# Altium project SHS_LCD176X220.PrjPcb
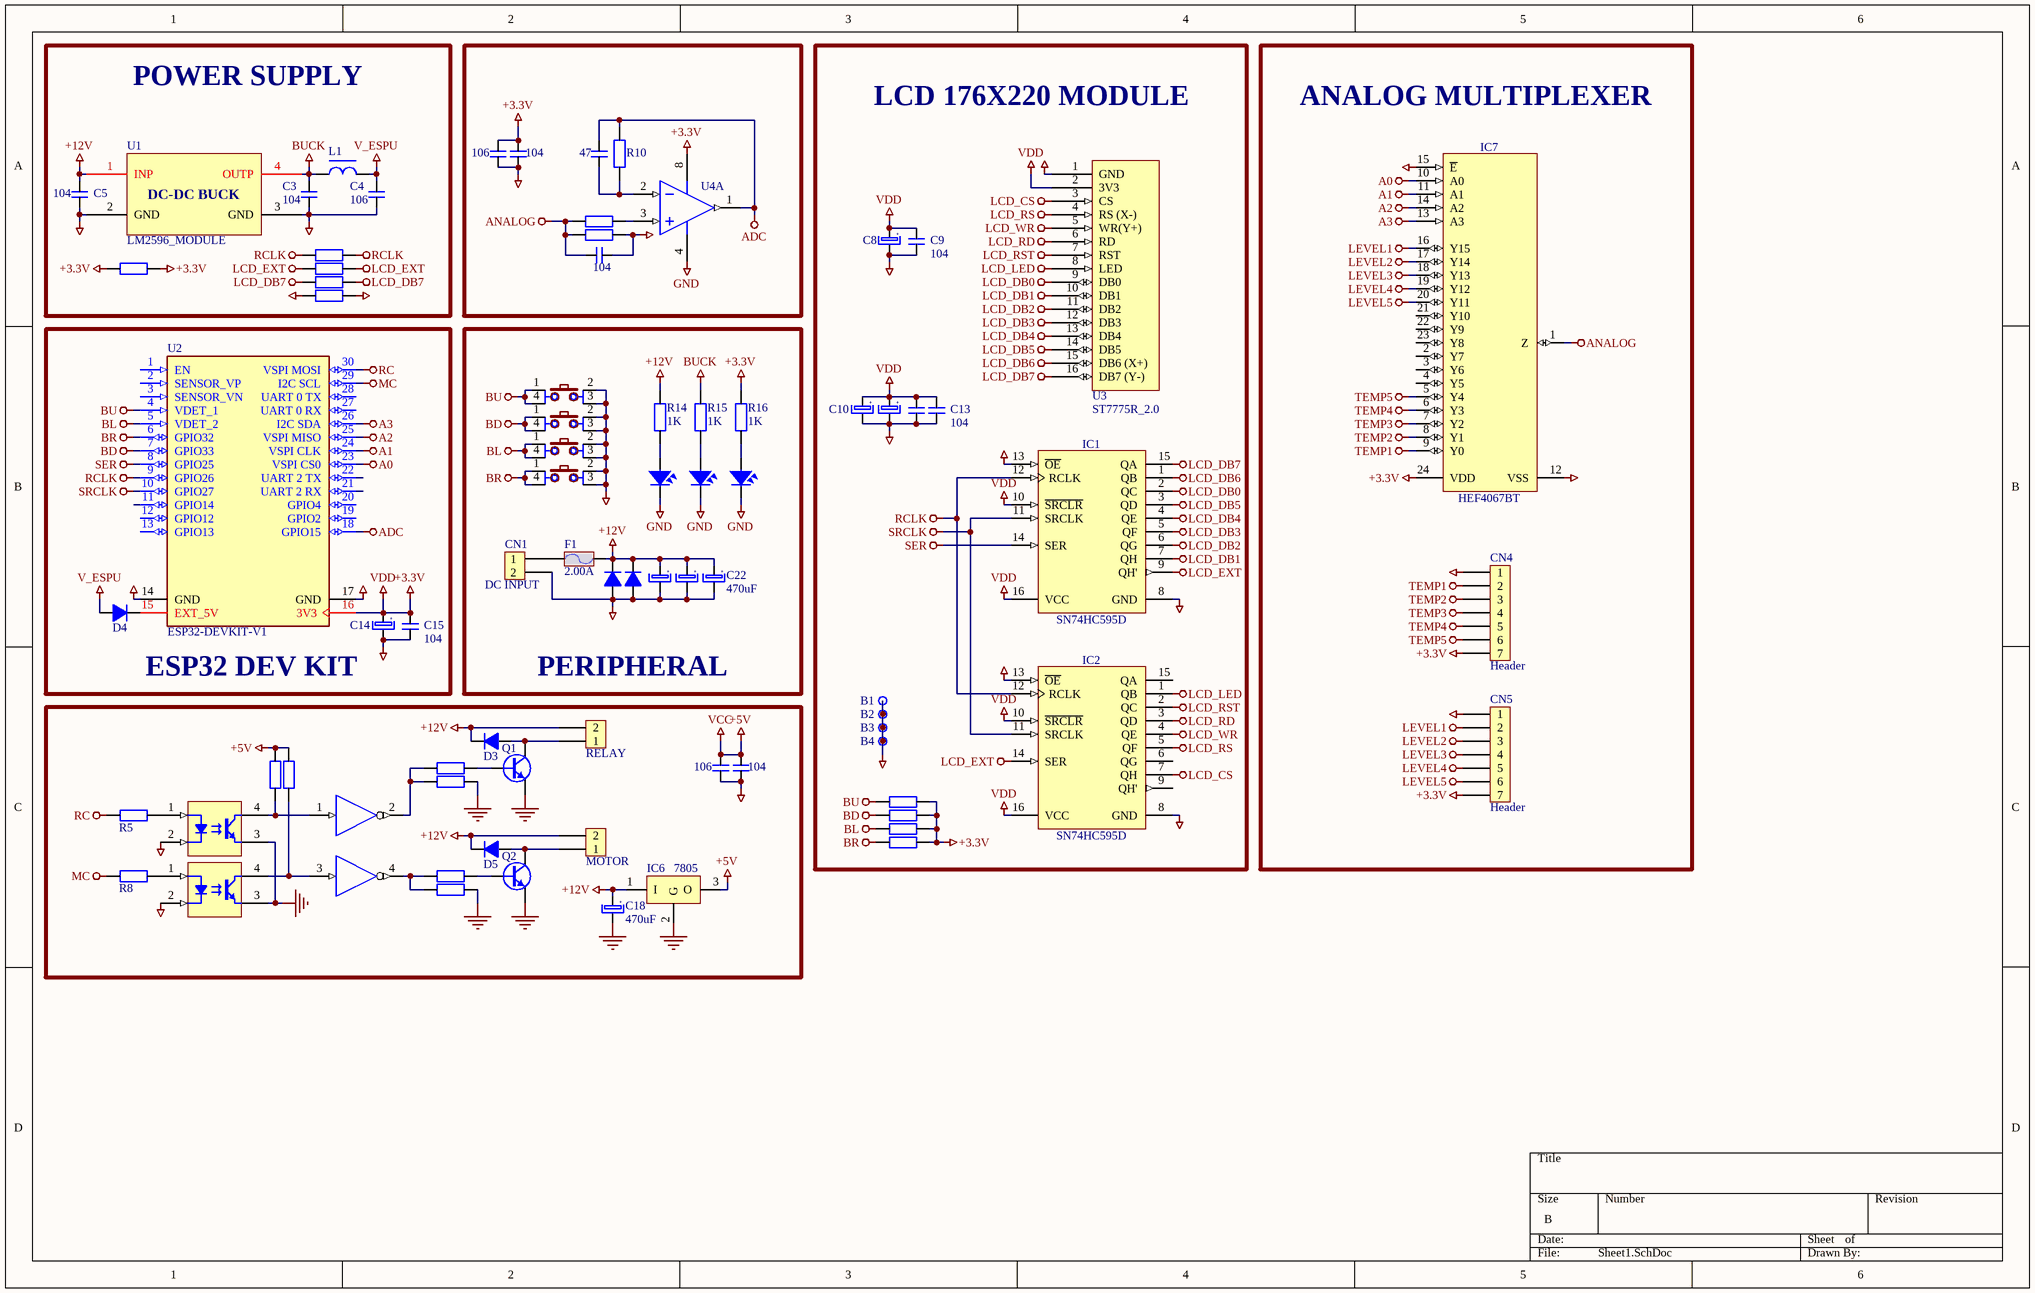
[diagram p0: Sheet1.SchDoc]
1 sheet, 80 parts. Net scope: global (net labels, ports and power ports of the same name join across sheets).
Board file: PCB1.PcbDoc

## Sheet Sheet1.SchDoc
size B

### Parts
B1  Plated Hole  [MTG300_600]  (value not drawn)
B2  Plated Hole  [MTG300_600]  (value not drawn)
B3  Plated Hole  [MTG300_600]  (value not drawn)
B4  Plated Hole  [MTG300_600]  (value not drawn)
C1  106  [CAP-SMD-0805]
C2  104  [CAP-SMD-0805]
C3  104  [Cap-Non-150mil]
C4  106  [CAP-SMD-0805]
C5  104  [Cap-Non-150mil]
C6  47  [CAP-SMD-0805]
C7  104  [CAP-SMD-0805]
C8  220uF  [Cap-P-2.5/5]  (value not drawn)
C9  104  [Cap-Non-150mil]
C10  220uF  [Cap-P-2.5/5]  (value not drawn)
C11  220uF  [Cap-P-2.5/5]  (value not drawn)
C12  104  [Cap-Non-150mil]  (value not drawn)
C13  104  [Cap-Non-150mil]
C14  220uF  [Cap-P-2.5/5]  (value not drawn)
C15  104  [Cap-Non-150mil]
C16  106  [CAP-SMD-0805]
C17  104  [CAP-SMD-0805]
C18  470uF  [Cap-P-3.8/6.3]
C20  470uF  [Cap-P-3.8/6.3]  (value not drawn)
C21  470uF  [Cap-P-3.8/6.3]  (value not drawn)
C22  470uF  [Cap-P-3.8/6.3]
CN1  DC INPUT  [KF2/5.08]
CN2  RELAY  [KF2/5.08]
CN3  MOTOR  [KF2/5.08]
CN4  Header  [Header 7P]
CN5  Header  [Header 7P]
D1  SS14  [SOD 106]  (value not drawn)
D2  SS14  [SOD 106]  (value not drawn)
D3  SS14  [SOD 106]  (value not drawn)
D4  SS14  [SOD 106]  (value not drawn)
D5  SS14  [SOD 106]  (value not drawn)
F1  2.00A  [Fuse-Dip1]
IC1  SN74HC595D  [SOIC127P600X175-16N]
IC2  SN74HC595D  [SOIC127P600X175-16N]
IC3  FOD817DSD  [DIP4]  (value not drawn)
IC4  74HC14D  [SOIC127P600X175-14N]  (value not drawn)  (parts A,B of 6)
IC5  FOD817DSD  [DIP4]  (value not drawn)
IC6  7805  [TO252]
IC7  HEF4067BT  [SOIC127P1032X265-24N]
L1  470uH  [L-DIP-M-5.3]  (value not drawn)
LED1  POWER  [LED-0805]  (value not drawn)
LED2  ESP-5.0V  [LED-0805]  (value not drawn)
LED3  ESP-3.3V  [LED-0805]  (value not drawn)
Q1  MJD122G  [TO228P991X239-3N-R552X520]  (value not drawn)
Q2  MJD122G  [TO228P991X239-3N-R552X520]  (value not drawn)
R1  1K  [RES-SMD-0805]  (value not drawn)
R2  1K  [RES-SMD-0805]  (value not drawn)
R3  1K  [RES-SMD-0805]  (value not drawn)
R4  10K  [RES-SMD-0805]  (value not drawn)
R5  1K  [RES-SMD-0805]  (value not drawn)
R6  1K  [RES-SMD-0805]  (value not drawn)
R7  10K  [RES-SMD-0805]  (value not drawn)
R8  1K  [RES-SMD-0805]  (value not drawn)
R10  10K  [RES-SMD-0805]  (value not drawn)
R11  10K  [RES-SMD-0805]  (value not drawn)
R12  1K  [RES-SMD-0805]  (value not drawn)
R13  1K  [RES-SMD-0805]  (value not drawn)
R14  1K  [RES-SMD-0805]
R15  1K  [RES-SMD-0805]
R16  1K  [RES-SMD-0805]
R17  0R  [RES-SMD-0805]  (value not drawn)
R18  0R  [RES-SMD-0805]  (value not drawn)
R19  0R  [RES-SMD-0805]  (value not drawn)
R20  0R  [RES-SMD-1206]  (value not drawn)
R21  1K  [RES-SMD-0805]  (value not drawn)
R22  1K  [RES-SMD-0805]  (value not drawn)
R23  1K  [RES-SMD-0805]  (value not drawn)
R27  0R  [RES-SMD-1206]  (value not drawn)
SW1  UP  [Button-Dip4/6x6]  (value not drawn)
SW2  DOWN  [Button-Dip4/6x6]  (value not drawn)
SW3  LEFT  [Button-Dip4/6x6]  (value not drawn)
SW4  RIGHT  [Button-Dip4/6x6]  (value not drawn)
U1  LM2596_MODULE  [LM2596_MODULE]
U2  ESP32-DEVKIT-V1  [MODULE_ESP32-DEVKITC-32D]
U3  ST7775R_2.0  [LCD_176X220_MODULE]
U4  LM6132  [SOIC-8S]  (value not drawn)  (part A of 2)

### Blocks framed on the sheet
POWER SUPPLY: C3-C5 L1 R17-R20 R27 U1
LCD 176X220 MODULE: B1-B4 C8-C13 IC1 IC2 R13 R21-R23 U3
ANALOG MULTIPLEXER: CN4 CN5 IC7
ESP32 DEV KIT: C14 C15 D4 U2
PERIPHERAL: C20-C22 CN1 D1 D2 F1 LED1-LED3 R14-R16 SW1-SW4

### Nets
+3.3V: C1.2 C2.2 C8.1 C9.2 C10.1 C11.1 C12.2 C13.2 C14.1 C15.2 CN4.7 CN5.7 IC1.10(~{SRCLR}) IC1.16(VCC) IC2.10(~{SRCLR}) IC2.16(VCC) IC7.24(VDD) R13.1 R16.2 R21.1 R22.1 R23.1 R27.1 R27.2 U2.16(3V3) U3.2(3V3) U4.8(V+)  [also labelled VDD]
+5V: C16.2 C17.2 IC4.14(VCC) IC6.3(O) R2.2 R3.2  [also labelled VCC]
+12V: C5.1 C18.1 C20.1 C21.1 C22.1 CN2.2 CN3.2 D1.2(K) D2.2(K) D3.2(K) D5.2(K) F1.2 IC6.1(I) R14.2 U1.1(INP)
A0: IC7.10(A0) U2.23(VSPI_CS0)
A1: IC7.11(A1) U2.24(VSPI_CLK)
A2: IC7.14(A2) U2.25(VSPI_MISO)
A3: IC7.13(A3) U2.26(I2C_SDA)
ADC: C6.2 R10.2 U2.18(GPIO15) U4.1(OUTA)
ANALOG: C7.1 IC7.1(Z) R11.1 R12.1
BD: R13.2 SW2.1 SW2.4 U2.7(GPIO33)
BL: R22.2 SW3.1 SW3.4 U2.5(VDET_2)
BR: R21.2 SW4.1 SW4.4 U2.6(GPIO32)
BU: R23.2 SW1.1 SW1.4 U2.4(VDET_1)
BUCK: C3.1 L1.1 R15.2 U1.4(OUTP)
GND: B1.1 B2.1 B3.1 B4.1 C1.1 C2.1 C3.2 C4.1 C5.2 C7.2 C8.2 C9.1 C10.2 C11.2 C12.1 C13.1 C14.2 C15.1 C16.1 C17.1 C18.2 C20.2 C21.2 C22.2 CN1.2 CN4.1 CN5.1 D1.1(A) D2.1(A) IC1.8(GND) IC1.13(~{OE}) IC2.8(GND) IC2.13(~{OE}) IC3.2(C) IC3.3(E) IC4.7(GND) IC5.2(C) IC5.3(E) IC6.2(G) IC7.12(VSS) IC7.15(~{E}) LED1.2 LED2.2 LED3.2 Q1.2(E) Q2.2(E) R4.1 R7.1 R12.2 R20.1 R20.2 SW1.2 SW1.3 SW2.2 SW2.3 SW3.2 SW3.3 SW4.2 SW4.3 U1.2(GND) U1.3(GND) U2.14(GND) U2.17(GND) U3.1(GND) U4.4(V-)
LCD_CS: IC2.7(QH) U3.3(CS)
LCD_DB0: IC1.2(QC) U3.9(DB0)
LCD_DB1: IC1.7(QH) U3.10(DB1)
LCD_DB2: IC1.6(QG) U3.11(DB2)
LCD_DB3: IC1.5(QF) U3.12(DB3)
LCD_DB4: IC1.4(QE) U3.13(DB4)
LCD_DB5: IC1.3(QD) U3.14(DB5)
LCD_DB6: IC1.1(QB) U3.15(DB6_(X+))
LCD_DB7: IC1.15(QA) R18.1 R18.2 U3.16(DB7_(Y-))
LCD_EXT: IC1.9(QH') IC2.14(SER) R19.1 R19.2
LCD_LED: IC2.1(QB) U3.8(LED)
LCD_RD: IC2.3(QD) U3.6(RD)
LCD_RS: IC2.5(QF) U3.4(RS_(X-))
LCD_RST: IC2.2(QC) U3.7(RST)
LCD_WR: IC2.4(QE) U3.5(WR(Y+))
LEVEL1: CN5.2 IC7.16(Y15)
LEVEL2: CN5.3 IC7.17(Y14)
LEVEL3: CN5.4 IC7.18(Y13)
LEVEL4: CN5.5 IC7.19(Y12)
LEVEL5: CN5.6 IC7.20(Y11)
MC: R8.2 U2.29(I2C_SCL)
RC: R5.2 U2.30(VSPI_MOSI)
RCLK: IC1.12(RCLK) IC2.12(RCLK) R17.1 R17.2 U2.9(GPIO26)
SER: IC1.14(SER) U2.8(GPIO25)
SRCLK: IC1.11(SRCLK) IC2.11(SRCLK) U2.10(GPIO27)
TEMP1: CN4.2 IC7.9(Y0)
TEMP2: CN4.3 IC7.8(Y1)
TEMP3: CN4.4 IC7.7(Y2)
TEMP4: CN4.5 IC7.6(Y3)
TEMP5: CN4.6 IC7.5(Y4)
V_ESPU: C4.2 D4.1(A) L1.2
NetC6_1: C6.1 R10.1 U4.2(INA-)
NetCN1_1: CN1.1 F1.1
NetCN2_1: CN2.1 D3.1(A) Q1.3(C)
NetCN3_1: CN3.1 D5.1(A) Q2.3(C)
NetD4_2: D4.2(K) U2.15(EXT_5V)
NetIC3_1: IC3.1(A) R5.1
NetIC3_4: IC3.4(C) IC4.1(IN) R2.1
NetIC4_2: IC4.2(OUT) R1.1 R4.2
NetIC4_3: IC4.3(IN) IC5.4(C) R3.1
NetIC4_4: IC4.4(OUT) R6.1 R7.2
NetIC5_1: IC5.1(A) R8.1
NetLED1_1: LED1.1 R14.1
NetLED2_1: LED2.1 R15.1
NetLED3_1: LED3.1 R16.1
NetQ1_1: Q1.1(B) R1.2
NetQ2_1: Q2.1(B) R6.2
NetR11_2: R11.2 U4.3(INA+)

Not connected (* = marked no-connect by the designer): IC2 6(QG) 9(QH') 15(QA); IC7 2(Y7) 3(Y6) 4(Y5) 21(Y10) 22(Y9) 23(Y8); U2 1(EN) 2(SENSOR_VP) 3(SENSOR_VN) 11(GPIO14) 12(GPIO12) 13(GPIO13) 19(GPIO2) 20(GPIO4) 21(UART_2_RX) 22(UART_2_TX) 27(UART_0_RX) 28(UART_0_TX)

### Notes on the sheet
- (in symbol Cap-Pol-Dip) +
- (in symbol LM2596_MODULE) DC-DC BUCK

### Library data of the parts
B1-B4 = PLATED_HOLE3.0_PAD6.0: Single Terminal Socket; Part Description: Plated Through Hole: Hole Dia.=3.0mm Pad Dia.=6.0mm; Mounted: No; Part Number: PLATED_HOLE3.0_PAD6.0; Component Kind: Standard (No BOM); Component Type: Standard (No BOM); Pin Count: 1; Family: Plated Hole; Socket: No; SMD: No; Sense: No; Status: None; ComponentHeight: 0mm; HelpURL: Undefined; Author: CERN DEM JLC; CreateDate: 5/26/2008; LatestRevisionDate: 5/26/2008; PackageDescription: Plated Through Hole: Hole Dia.=3.0mm Pad Dia.=6.0mm
C1 C2 C4 C6 C7 C16 C17 = Cap-Non-SMD: Non-polar capacitor
C3 C5 C9 C12 C13 C15 = Cap-Non-Dip: Non-polar capacitor
C8 C10 C11 C14 C18 C20-C22 = Cap-Pol-Dip: Polarized capacitor
CN1-CN3 = KF 2
CN4 CN5 = Header 7
D1-D5 = Diode SMD
F1 = Fuse Dip
IC1 IC2 = SN74HC595D: 8-Bit Shift Register With 3-State Output Register; Part Description: 8-Bit Shift Register With 3-State Output Registers; Manufacturer: TEXAS INSTRUMENTS; PressFit: No; Bonding: No; Part Number: SN74HC595D; Component Kind: Standard; Component Type: Standard; Device: SN74HC595D; PackageDescription: SOIC 16, Pitch 1.27mm - Body 4x10mm, IPC Medium Density; Manufacturer Part Number: SN74HC595D; Pin Count: 16; Case: SOIC16; Mounted: Yes; Socket: No; SMD: Yes; Sense: No; ComponentHeight: 1.75mm; Author: CERN DEM JLC; HelpURL: \\cern.ch\dfs\Applications\Altium\Datasheets\SN74HC595D.pdf; CreateDate: 6/5/2012; LatestRevisionDate: 6/5/2012
IC3 IC5 = FOD817DSD: Single Optocoupler; Part Description: 4-Pin High Operating Temperature Phototransistor Optocoupler; Manufacturer: FAIRCHILD SEMICONDUCTOR; PressFit: No; Bonding: No; Part Number: FOD817DSD; Component Kind: Standard; Component Type: Standard; Device: FOD817DSD; Footprint: FAIRCHILD_FOD817DSD; PackageDescription: SOIC, 2.54mm Pitch, 4 Pin, Body 6.5mm W X 4.6mm L X 4.6mm H; Manufacturer Part Number: FOD817DSD; Pin Count: 4; Case: SOIC4; Mounted: Yes; Socket: No; SMD: Yes; Sense: No; ComponentHeight: 4.6mm; HelpURL: \\cern.ch\dfs\Applications\Altium\Datasheets\FOD817DSD.pdf; Author: CERN DEM JLC; CreateDate: 7/21/2014; LatestRevisionDate: 7/21/2014
IC4 = 74HC14D: Hex Schmitt-Trigger Inverter; Part Description: Hex  Inverterting Schmitt-Trigger; Manufacturer: NXP SEMICONDUCTORS; PressFit: No; Bonding: No; Part Number: 74HC14D; Component Kind: Standard; Component Type: Standard; Device: 74HC14D; PackageDescription: SOIC 14, Pitch 1.27mm - Body 4x8.75mm, IPC Medium Density; Manufacturer Part Number: 74HC14D; Pin Count: 14; Case: SOIC14; Mounted: Yes; Socket: No; SMD: Yes; Sense: No; ComponentHeight: 1.75mm; Author: CERN DEM JLC; HelpURL: \\cern.ch\dfs\Applications\Altium\Datasheets\74HC14D.pdf; CreateDate: 8/26/2014; LatestRevisionDate: 8/26/2014
IC6 = 7805: Power IC, 5V-1A
IC7 = HEF4067BT: 16-Channel Analog Multiplexer/Demultiplexer; Manufacturer: NXP SEMICONDUCTORS; PressFit: No; Bonding: No; Part Number: HEF4067BT; Component Kind: Standard; Component Type: Standard; Device: HEF4067BT; PackageDescription: SOIC, 1.27mm Pitch; 24 Pin,7.50mm W X 15.40mm L X 2.65mm H Body, IPC Medium Density; Part Description: 16-Channel Analog Multiplexer/Demultiplexer; Manufacturer Part Number: HEF4067BT; Pin Count: 24; Case: SOIC24; Mounted: Yes; Socket: No; SMD: Yes; Sense: No; ComponentHeight: 2.65mm; Author: CERN DEM JLC; HelpURL: \\cern.ch\dfs\Applications\Altium\Datasheets\HEF4067BT.pdf; CreateDate: 5/14/2013; LatestRevisionDate: 5/14/2013
L1 = IND-DIP-1: Inductor; Value: 150 mH
LED1-LED3 = LED_SMD
Q1 Q2 = MJD340G: NPN Transistor; Part Description: 300V 500mA 15W NPN High Voltage Power Transistor; Manufacturer: ON SEMICONDUCTOR; PressFit: No; Bonding: No; Part Number: MJD340G; Component Kind: Standard; Component Type: Standard; Device: MJD340G; PackageDescription: TO-252AA DPAK TO, 2.28mm pitch; 2 pin,9.905mm L X 6.095mm W X 2.39mm H body, IPC Medium Density; Manufacturer Part Number: MJD340G; Pin Count: 3; Case: DPAK; Mounted: Yes; Socket: No; SMD: Yes; Sense: No; ComponentHeight: 2.38mm; HelpURL: \\cern.ch\dfs\Applications\Altium\Datasheets\MJD340G.pdf; Author: CERN DEM JLC; CreateDate: 9/23/2014; LatestRevisionDate: 9/23/2014
R1-R8 R13-R16 R21-R23 R27 = Res 1/4W: Resistor 1/4W
R10-R12 R17-R20 = Res SMD: Resistor SMD
SW1-SW4 = Button-4: Switch button 4 pin; Value: Button chip 4 pin
U2 = ESP32-DEVKIT-V1: - Transceiver; 802.11 b/g/n _Wi-Fi, WiFi, WLAN_, Bluetooth® Smart Ready 4.x Dual Mode For Use With ESP-WROOM-32; MF: Espressif Systems; MP: ESP32-DEVKITC-32D; Package: None; Price: None; Availability: Unavailable; SnapEDA_Link: https://www.snapeda.com/parts/ESP32-DEVKITC-32D/Espressif%20Systems/view-part/2777395/?ref=snap; Value: *
U3 = LCD_176x220_ST7775R: ComponentLink1Description: Wiki; ComponentLink1URL: http://www.lcdwiki.com/2.8inch_SPI_Module_ILI9341_SKU:MSP2807
U4 = LM6132AIM: Dual Low Power 10 MHz Rail-to-Rail I/O Operational Amplifier, 8-pin Narrow SOIC; Manufacturer: National Semiconductor; PackageTopMarking: NSZXTT*LM61*32AIM; PowerWise: N; CompType: Amplifiers; Published: 4-Dec-2008; LatestRevisionDate: 13-Jan-2009; LatestRevisionNote: Sim Model Added.; DatasheetVersion: Nov-2004; PackageVersion: revM, May-2009; PackageReference: M08A; Publisher: Altium Limited; PackageDescription: SOIC Narrow, 4.9 x 3.9 x 1.45mm, 8 Lead, 1.27mm Pitch; Supplier 1: Farnell; Supplier Part Number 1: 9490043; PartNumber: LM6132AIM; RoHS: N; PinCount: 8; Code_JEDEC: MS-012-AA; Code_IPC: SOIC127P600-8; ComponentLink1Description: LM6132 Datasheet; ComponentLink1URL: http://www.national.com/ds/LM/LM6132.pdf; ComponentLink2Description: LM6132 Web Page; ComponentLink2URL: http://www.national.com/pf/LM/LM6132.html; ComponentLink3Description: M08A Package Page; ComponentLink3URL: http://www.national.com/packaging/folders/m08a.html
U1 = LM2596_MODULE: ComponentLink1Description: DATASHEET; ComponentLink1URL: http://tpelectronic.ir/datasheets/20150123144301750.pdf